# EAGLE schematic MAX31865 (EAGLE 6.6.0)
ABBREV: rf1; PROJECT: RFM12B Board
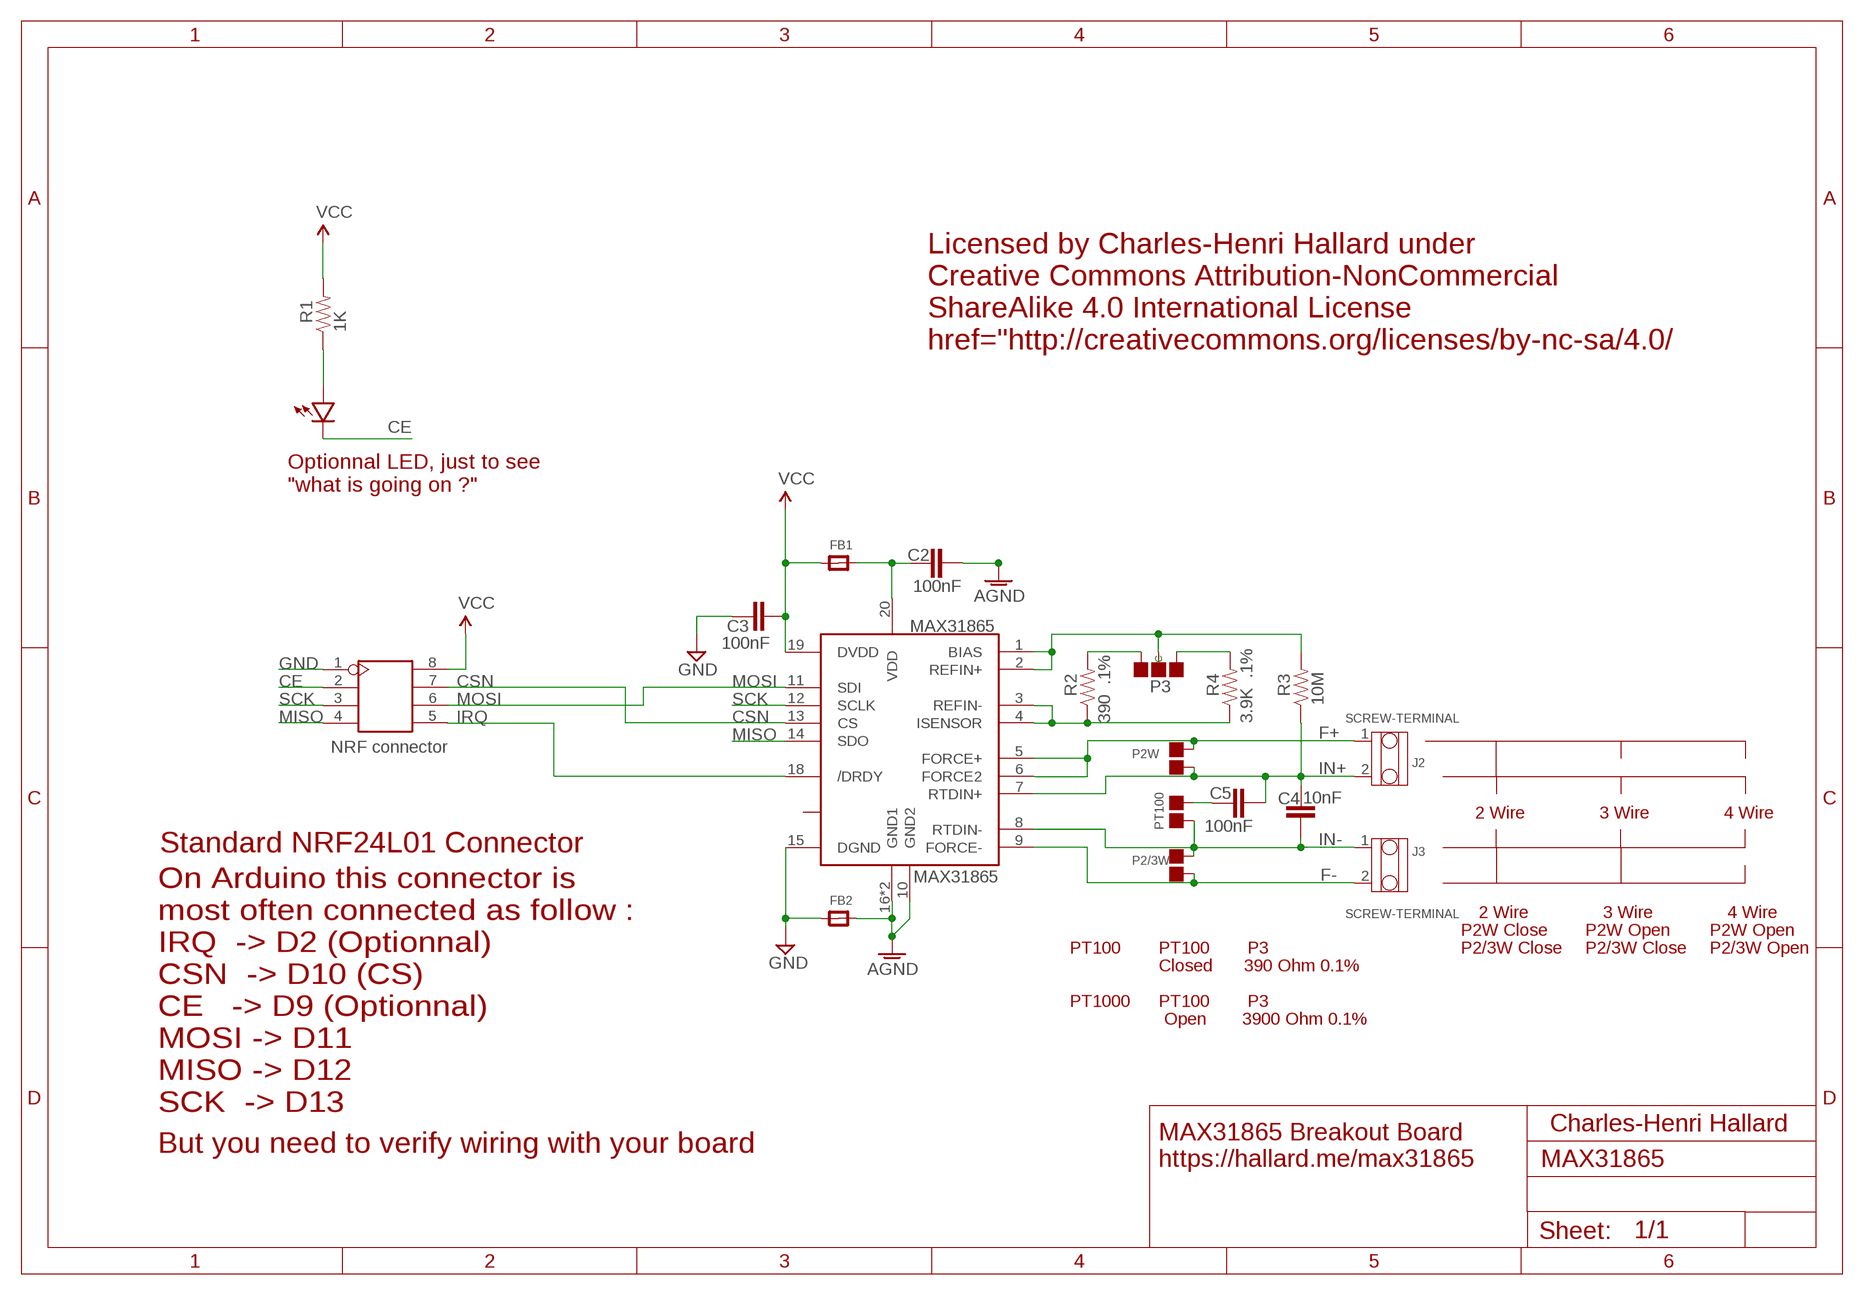
[diagram p0: schematic, sheet 1]

## Parts
C2  100nF  CAP0603-CAP  [0603-CAP]
C3  100nF  CAP0603-CAP  [0603-CAP]
C4  10nF  CAP0603-CAP  [0603-CAP]
C5  100nF  CAP0603-CAP  [0603-CAP]
FB1  FERRITE_0603MP  [_0603MP]
FB2  FERRITE_0603MP  [_0603MP]
J1  NRF connector  HEADER-2X4P-2.54  [2X4P-2.54]
J2  SCREW-TERMINAL  SCREW-TERMINAL-2P-3470070P1  [2P-3.5]
J3  SCREW-TERMINAL  SCREW-TERMINAL-2P-3470070P1  [2P-3.5]
MAX31865  MAX31865  [TQFN20-5X5]
P2/3W  4 Wire  PAD-JUMPER-2P  [2P-SMD-1.78X1.27]
P2W  3 Wire  PAD-JUMPER-2P  [2P-SMD-1.78X1.27]
P3  PAD-JUMPER-3P-40*40  [3P-SMD-4.1X1.5]
PT100  PAD-JUMPER-2P  [2P-SMD-1.78X1.27]
R1  1K  RESISTOR0603-RES  [0603-RES]
R2  390 .1%  RESISTOR0805-RES  [0805-RES]
R3  10M  RESISTOR0603-RES  [0603-RES]
R4  3.9K .1%  RESISTOR0805-RES  [0805-RES]
U$1  LED0805-LARGE  [0805-LED-LARGEPADS]

## Nets
AGND [power]: C2.2 FB2.2 MAX31865.10(GND2) MAX31865.16(GND1) MAX31865.EXP(GND1)
AVDD [power]: C2.1 FB1.2 MAX31865.20(VDD)
CE: J1.2 U$1.MINUS
CSN: J1.7 MAX31865.13(CS)
F+: J2.1 MAX31865.5(FORCE+) MAX31865.6(FORCE2) P2W.2
F-: J3.2 MAX31865.9(FORCE-) P2/3W.1
GND [power]: C3.2 FB2.1 J1.1 MAX31865.15(DGND)
IN+: C4.1 C5.2 J2.2 MAX31865.7(RTDIN+) P2W.1 R3.1
IN-: C4.2 J3.1 MAX31865.8(RTDIN-) P2/3W.2 PT100.1
IRQ: J1.5 MAX31865.18(/DRDY)
MISO: J1.4 MAX31865.14(SDO)
MOSI: J1.6 MAX31865.11(SDI)
N$2: R1.1 U$1.PLUS
N$6: P3.11(R) R2.2
N$7: MAX31865.3(REFIN-) MAX31865.4(ISENSOR) R2.1 R4.1
N$9: MAX31865.1(BIAS) MAX31865.2(REFIN+) P3.MM(C) R3.2
N$10: P3.00(L) R4.2
N$11: C5.1 PT100.2
SCK: J1.3 MAX31865.12(SCLK)
VCC [power]: C3.1 FB1.1 J1.8 MAX31865.19(DVDD) R1.2
Unconnected: MAX31865.17(NC)

## Notes on the sheet
- Licensed by Charles-Henri Hallard under
  Creative Commons Attribution-NonCommercial
  ShareAlike 4.0 International License
  href="http://creativecommons.org/licenses/by-nc-sa/4.0/
- Optionnal LED, just to see
  "what is going on ?"
- 2 Wire | 3 Wire | 4 Wire
- Standard NRF24L01 Connector
- 2 Wire | 3 Wire | 4 Wire
- P2W Close | P2W Open | P2W Open
- PT100 | PT100 | P3 | P2/3W Close | P2/3W Close | P2/3W Open
- Closed | 390 Ohm 0.1%
- PT1000 | PT100 | P3
- Open | 3900 Ohm 0.1%
- On Arduino this connector is
  most often connected as follow :
  IRQ  -> D2 (Optionnal)
  CSN  -> D10 (CS)
  CE   -> D9 (Optionnal)
  MOSI -> D11  
  MISO -> D12
  SCK  -> D13
- Charles-Henri Hallard
- But you need to verify wiring with your board
- MAX31865 Breakout Board
  https://hallard.me/max31865

## Library data of the parts
C2-C5 = _c2h:CAP: Capacitor Standard 0603 ceramic capacitor, and 0.1" leaded capacitor.
FB1 FB2 = microbuilder:FERRITE: Ferrite Bead 0603 MMZ1608B121C - 120 Ohm @ 100MHz, 600mA, 0.15 Ohm DC Resistance - Digikey: 445-2164-1-ND BK1608HW121-T - 120 Ohm, 600mA Ferrite Chip - Digikey: 587-1876-2-ND 0805 HZ0805B272R-10 - 2.7K Ohm @ 100MHz, 200mA, 0.8 Ohm DC Resistance - Digikey: 240-2504-1-ND (see also Murata BLM21BD272SN1L) MMZ2012Y152B - 1.5K Ohm @ 100MHz, 500mA, 0.4 Ohm DC Resistance - Digikey: 445-1560-1-ND - Mainly for high frequency (80-400MHz) MMZ2012R102A - 1K Ohm @ 100MHz, 500mA, 0.3 Ohm DC Resistance - Digikey: 445-1555-2-ND - More general purpose (10-200MHz)
J1 = Seeed-Connector:HEADER-2X4P
J2 J3 = seeed-OPL:SCREW-TERMINAL-2P
MAX31865 = _c2h:MAX31865: MPR121 Capacitive Touch Sensor Controller. Variant "V2" was created using an image import of the bottom of the IC. It matches metal to metal.
P2/3W P2W PT100 = Seeed-Discrete:PAD-JUMPER-2P; PARTNO: DNP
P3 = Seeed-Discrete:PAD-JUMPER-3P; PARTNO: DNP
R1-R4 = _c2h:RESISTOR: Resistor Basic schematic elements and footprints for 0603, 1206, and PTH resistors.
U$1 = _c2h:LED

## Net classes
1 power: width 0.203 mm, drill 0.305 mm, clearance 0.152 mm